# EAGLE design COM - ISP (EAGLE 4.11)
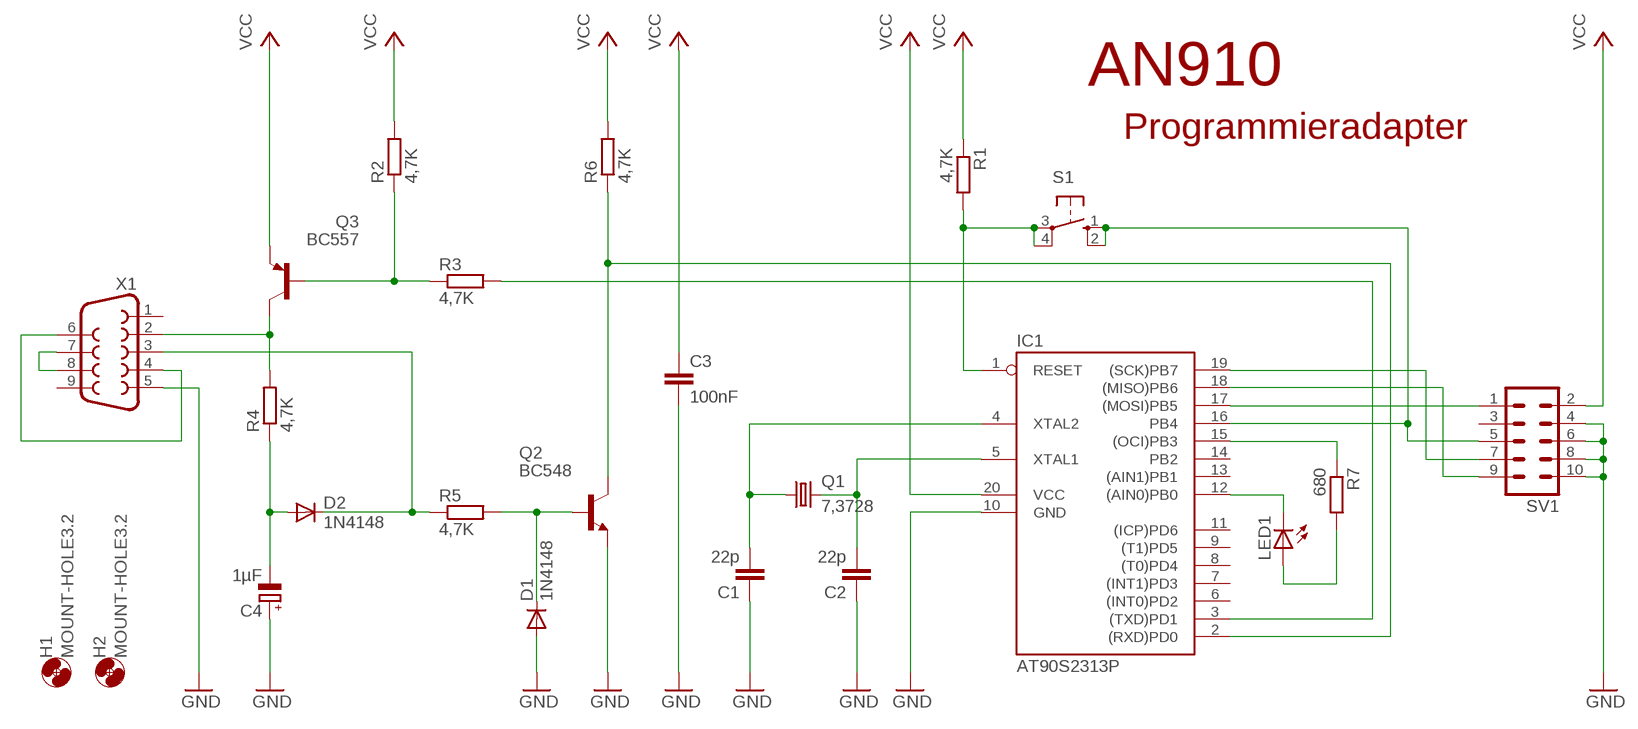
[diagram p0: schematic, sheet 1]

## Parts
C1  22p  C-EU025-024X044  [C025-024X044]
C2  22p  C-EU025-024X044  [C025-024X044]
C3  100nF  C-EU025-024X044  [C025-024X044]
C4  1µF  CPOL-EUE2.5-6  [E2,5-6]
D1  1N4148  BAS15  [DO34-7]
D2  1N4148  BAS15  [DO34-7]
H1  MOUNT-HOLE3.2  [3,2]
H2  MOUNT-HOLE3.2  [3,2]
IC1  AT90S2313P  [DIL20]
LED1  LED3MM  [LED3MM]
Q1  7,3728  CRYTALHC49U-V  [HC49U-V]
Q2  BC548  [TO92-EBC]
Q3  BC557  [TO92-EBC]
R1  4,7K  R-EU_0207/7  [0207/7]
R2  4,7K  R-EU_0207/7  [0207/7]
R3  4,7K  R-EU_0207/7  [0207/7]
R4  4,7K  R-EU_0207/7  [0207/7]
R5  4,7K  R-EU_0207/7  [0207/7]
R6  4,7K  R-EU_0207/7  [0207/7]
R7  680  R-EU_0207/7  [0207/7]
S1  10-XX  [B3F-10XX]
SV1  ML10L  [ML10L]
X1  F09HP  [F09HP]

## Nets
GND: C1.1 C2.1 C3.2 C4.+ D1.A IC1.10(GND) Q2.E SV1.4 SV1.6 SV1.8 SV1.10 X1.5
N$1: C1.2 IC1.4(XTAL2) Q1.1
N$2: C2.2 IC1.5(XTAL1) Q1.2
N$3: IC1.15((OCI)PB3) R7.1
N$4: LED1.A R7.2
N$5: IC1.12((AIN0)PB0) LED1.K(C)
N$7: IC1.1(RESET) R1.2 S1.3(P) S1.4(P1)
N$8: IC1.16(PB4) S1.1(S) S1.2(S1) SV1.5
N$9: IC1.19((SCK)PB7) SV1.7
N$10: IC1.18((MISO)PB6) SV1.9
N$11: IC1.17((MOSI)PB5) SV1.1
N$13: Q3.C R4.2 X1.2
N$15: Q3.B R2.1 R3.1
N$16: D1.C Q2.B R5.2
N$17: IC1.2((RXD)PD0) Q2.C R6.1
N$18: D2.C R5.1 X1.3
N$19: IC1.3((TXD)PD1) R3.2
N$20: C4.- D2.A R4.1
N$21: X1.7 X1.8
N$22: X1.4 X1.6
VCC: C3.1 IC1.20(VCC) Q3.E R1.1 R2.2 R6.2 SV1.2
Unconnected: IC1.6((INT0)PD2) IC1.7((INT1)PD3) IC1.8((T0)PD4) IC1.9((T1)PD5) IC1.11((ICP)PD6) IC1.13((AIN1)PB1) IC1.14(PB2) SV1.3 X1.1 X1.9

## Notes on the sheet
- AN910
- Programmieradapter

## Library data of the parts
C1-C3 = rcl:C-EU: CAPACITOR, European symbol
C4 = rcl:CPOL-EU: POLARIZED CAPACITOR, European symbol
D1 D2 = diode:BAS15: DIODE high speed
H1 H2 = holes:MOUNT-HOLE: MOUNTING HOLE with drill center marker
IC1 = atmel:AT90S2313: MICROCONTROLLER 2 Kbytes FLASH 128 bytes SRAM 128 bytes EEPROM UART
LED1 = led:LED: LED OSRAM: - CHIPLED LG R971, LG N971, LY N971, LG Q971, LY Q971, LO R971, LY R971 LH N974, LH R974 LS Q976, LO Q976, LY Q976 LO Q996 - Hyper CHIPLED LW Q18S LB Q993, LB Q99A, LB R99A - SideLED LS A670, LO A670, LY A670, LG A670, LP A670 LB A673, LV A673, LT A673, LW A673 LH A674 LY A675 LS A676, LA A676, LO A676, LY A676, LW A676 LS A679, LY A679, LG A679 - Hyper Micro SIDELED® LS Y876, LA Y876, LO Y876, LY Y876 LT Y87S - SmartLED LW L88C, LW L88S LB L89C, LB L89S, LG L890 LS L89K, LO L89K, LY L89K LS L896, LA L896, LO L896, LY L896 - TOPLED LS T670, LO T670, LY T670, LG T670, LP T670 LSG T670, LSP T670, LSY T670, LOP T670, LYG T670 LG T671, LOG T671, LSG T671 LB T673, LV T673, LT T673, LW T673 LH T674 LS T676, LA T676, LO T676, LY T676, LB T676, LH T676, LSB T676, LW T676 LB T67C, LV T67C, LT T67C, LS T67K, LO T67K, LY T67K, LW E67C LS E67B, LA E67B, LO E67B, LY E67B, LB E67C, LV E67C, LT E67C LW T67C LS T679, LY T679, LG T679 LS T770, LO T770, LY T770, LG T770, LP T770 LB T773, LV T773, LT T773, LW T773 LH T774 LS E675, LA E675, LY E675, LS T675 LS T776, LA T776, LO T776, LY T776, LB T776 LHGB T686 LT T68C, LB T68C - Hyper Mini TOPLED® LB M676 - Mini TOPLED Santana® LG M470 LS M47K, LO M47K, LY M47K Source: http://www.osram.convergy.de/
Q1 = crystal:CRYTAL: CRYSTAL
Q2 = transistor-npn:BC548*: NPN Transistor
Q3 = transistor-pnp:BC557*: PNP Transistror
R1-R7 = rcl:R-EU_: RESISTOR, European symbol
S1 = switch-omron:10-XX: OMRON SWITCH
SV1 = con-harting-ml:ML10: HARTING
X1 = con-subd:F09: SUB-D

## Board
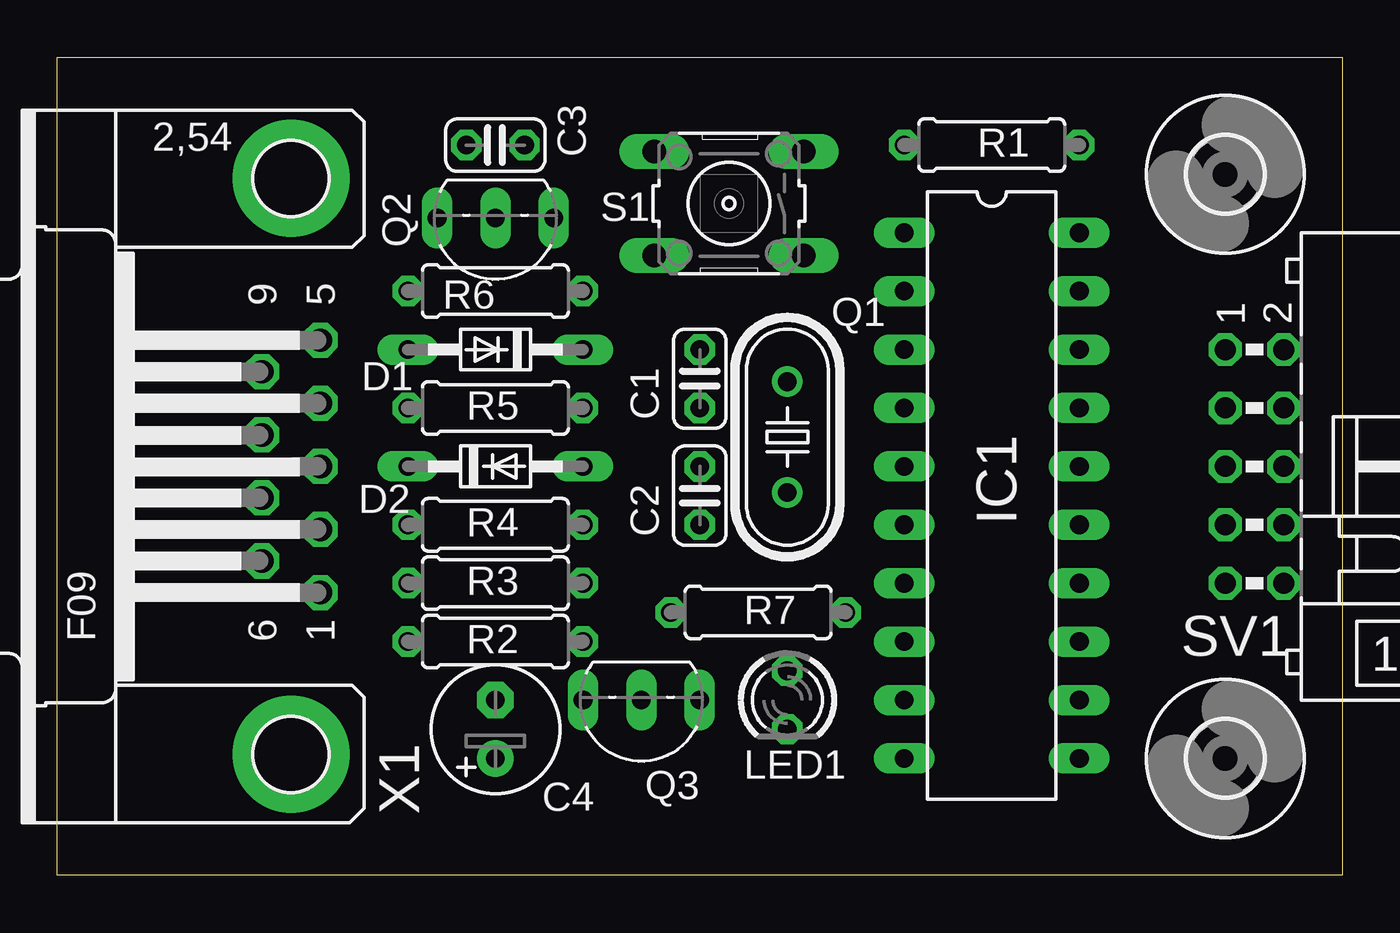
[diagram p1: board, top side]
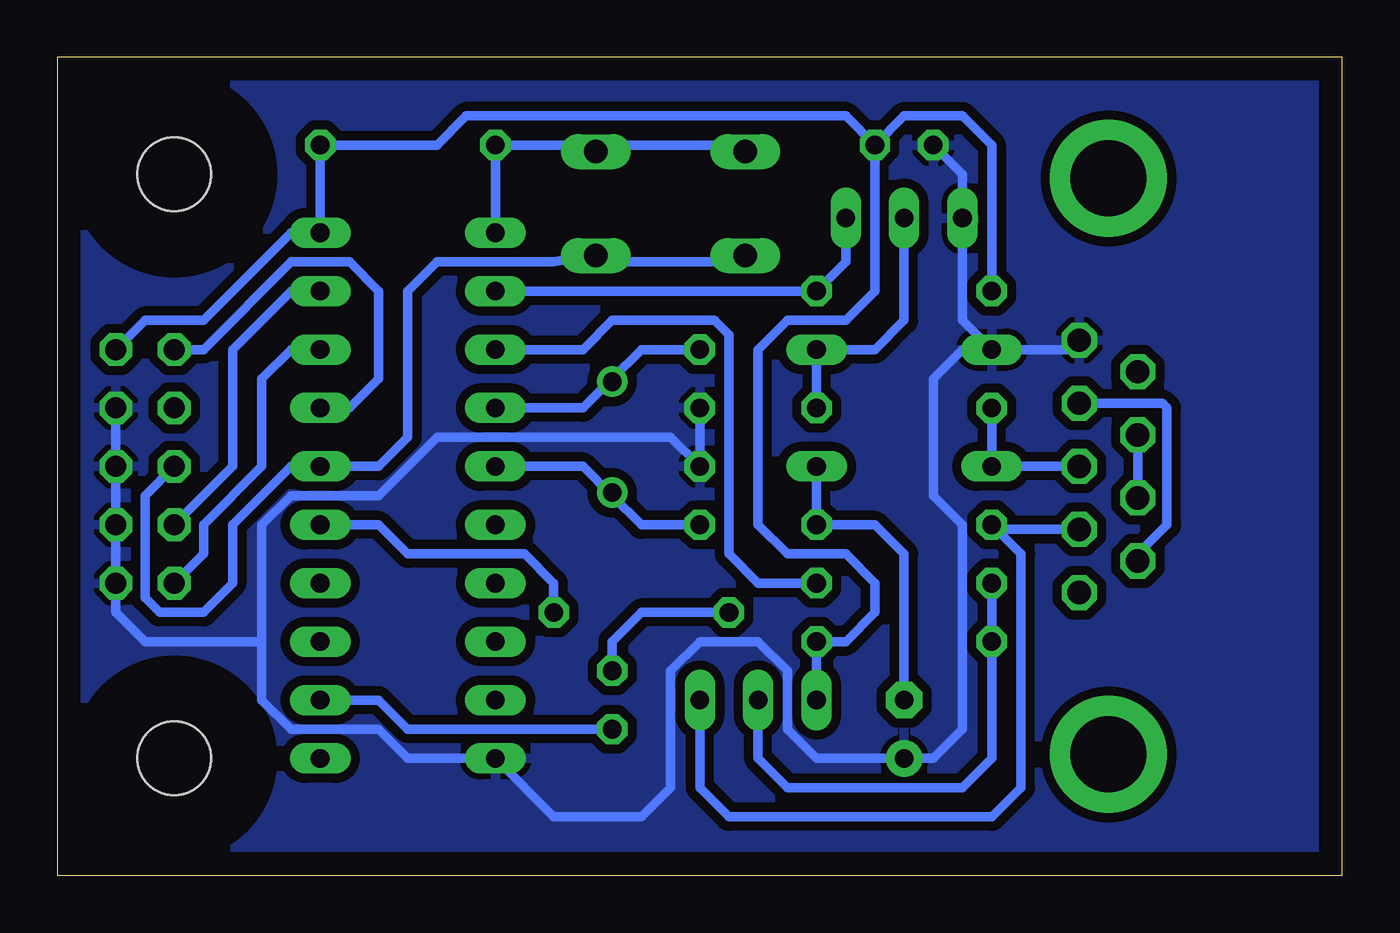
[diagram p2: board, bottom side, seen from below]

Size 55.88 x 35.56 mm. Coordinates in mm from the lower left corner, seen from the top.
Outline: 0,0 0,35.56 55.88,35.56 55.88,0 0,0
Copper layers (1*16): Top 0.035mm / dielectric 1.5mm / Bottom 0.035mm
Design rules "default": minimum track width 10mil, minimum drill 24mil, track to track 8mil, track to pad 8mil, pad to pad 8mil, via to via 8mil, smd to smd 8mil, copper to edge 40mil, drill to drill 8mil, minimum pad ring 10mil, minimum via ring 8mil, stop-mask expansion 4mil, vias tented up to drill 0mil, thermal gap 10mil

### Footprints (pad centres in the part's own frame; a part is rotated, then mirrored left to right if it is on the bottom)
C025-024X044 = drill 0.813 octagon: 1 -1.27,0; 2 1.27,0
E2,5-6 = drill 0.813 pad 1.6 round: + -1.27,0 | drill 0.813 pad 1.6 octagon: - 1.27,0
DO34-7 = drill 0.813 long: A 3.81,0; C -3.81,0
3,2 = hole 3.2: 0,0
DIL20 = drill 0.813 long: 1 -11.43,-3.81; 2 -8.89,-3.81; 3 -6.35,-3.81; 4 -3.81,-3.81; 5 -1.27,-3.81; 6 1.27,-3.81; 7 3.81,-3.81; 8 6.35,-3.81; 9 8.89,-3.81; 10 11.43,-3.81; 11 11.43,3.81; 12 8.89,3.81; 13 6.35,3.81; 14 3.81,3.81; 15 1.27,3.81; 16 -1.27,3.81; 17 -3.81,3.81; 18 -6.35,3.81; 19 -8.89,3.81; 20 -11.43,3.81
LED3MM = drill 0.813 octagon: A -1.27,0; K 1.27,0
HC49U-V = drill 0.813 round: 1 -2.413,0; 2 2.413,0
TO92-EBC = drill 0.813 long: B 0,-1.27; C -2.54,-1.27; E 2.54,-1.27
0207/7 = drill 0.813 octagon: 1 -3.81,0; 2 3.81,0
B3F-10XX = drill 1.016 long: 1 -3.251,2.261; 2 3.251,2.261; 3 -3.251,-2.261; 4 3.251,-2.261
ML10L = drill 0.914 octagon: 1 -5.08,-1.27; 2 -5.08,1.27; 3 -2.54,-1.27; 4 -2.54,1.27; 5 0,-1.27; 6 0,1.27; 7 2.54,-1.27; 8 2.54,1.27; 9 5.08,-1.27; 10 5.08,1.27
F09HP = drill 1.016 octagon: 1 -5.486,-1.27; 2 -2.743,-1.27; 3 0,-1.27; 4 2.743,-1.27; 5 5.486,-1.27; 6 -4.115,1.27; 7 -1.372,1.27; 8 1.372,1.27; 9 4.115,1.27 | drill 3.302 pad 5.08 round: G1 -12.522,0; G2 12.522,0

### Placement (x,y rotation side)
C1  27.94,21.59 90 top
C2  27.94,16.51 270 top
C3  19.05,31.75 180 top
C4  19.05,6.35 90 top
D1  19.05,22.86 180 top
D2  19.05,17.78 0 top
H1  50.8,5.08 0 top
H2  50.8,30.48 0 top
IC1  40.64,16.51 270 top
LED1  31.75,7.62 270 top
Q1  31.75,19.05 270 top
Q2  19.05,27.3 180 top
Q3  25.4,6.35 180 top
R1  40.64,31.75 180 top
R2  19.05,10.16 0 top
R3  19.05,12.7 0 top
R4  19.05,15.24 180 top
R5  19.05,20.32 0 top
R6  19.05,25.4 180 top
R7  30.48,11.43 180 top
S1  29.21,29.21 180 top
SV1  52.07,17.78 270 top
X1  10.16,17.78 90 top

### Tracks (layer width: path | path; a pad name or v marks a point on that pad's centre or on a via)
GND
  Bottom 0.406: SV1.4 SV1.6 SV1.8 SV1.10 53.34,11.43 52.07,10.16 46.99,10.16 | C1.1 C2.1 29.21,19.05 39.37,19.05 41.91,16.51 45.72,16.51 46.99,15.24 46.99,10.16 | C3.2 16.51,30.48 Q2.E 16.51,24.13 D1.A | D1.A 16.51,22.86 17.78,21.59 17.78,16.51 16.51,15.24 16.51,6.35 17.78,5.08 C4.+ 22.86,5.08 24.13,6.35 24.13,8.89 25.4,10.16 27.94,10.16 29.21,8.89 29.21,3.81 30.48,2.54 34.29,2.54 IC1.10 40.64,5.08 41.91,6.35 45.72,6.35 46.99,7.62 46.99,10.16 | X1.5 11.43,22.86 D1.A
  pour Bottom (isolate 0.406): -1.27,36.83 57.15,36.83 57.15,-1.27 -1.27,-1.27
N$1
  Bottom 0.406: IC1.4 33.02,20.32 31.75,21.59 | Q1.1 31.75,21.59 | 31.75,21.59 30.48,22.86 C1.2
N$2
  Bottom 0.406: IC1.5 33.02,17.78 31.75,16.51 | 31.75,16.51 Q1.2 | 31.75,16.51 30.48,15.24 C2.2
N$3
  Bottom 0.406: R7.1 34.29,12.7 35.56,13.97 40.64,13.97 41.91,15.24 IC1.15
N$4
  Bottom 0.406: R7.2 30.48,11.43 31.75,10.16 LED1.A
N$5
  Bottom 0.406: LED1.K 40.64,6.35 41.91,7.62 IC1.12
N$7
  Bottom 0.406: IC1.1 R1.2 33.02,31.75 32.74,31.47 S1.3 32.03,31.47 31.75,31.75 26.67,31.75 26.39,31.47 S1.4
N$8
  Bottom 0.406: SV1.5 52.07,16.51 52.07,12.06 51.44,11.43 49.53,11.43 48.26,12.7 48.26,15.24 45.72,17.78 IC1.16 41.91,17.78 40.64,19.05 40.64,25.4 39.37,26.67 34.29,26.67 32.74,26.95 S1.1 32.03,26.95 31.75,26.67 26.67,26.67 26.39,26.95 S1.2
N$9
  Bottom 0.406: IC1.19 45.72,25.4 48.26,22.86 48.26,17.78 SV1.7
N$10
  Bottom 0.406: IC1.18 45.72,22.86 46.99,21.59 46.99,17.78 49.53,15.24 49.53,13.97 SV1.9
N$11
  Bottom 0.406: IC1.17 43.18,20.32 41.91,21.59 41.91,25.4 43.18,26.67 45.72,26.67 49.53,22.86 SV1.1
N$13
  Bottom 0.406: X1.2 15.04,15.04 R4.2 13.97,13.97 13.97,3.81 15.24,2.54 26.67,2.54 27.94,3.81 Q3.C
N$15
  Bottom 0.406: R3.1 R2.1 15.24,5.08 16.51,3.81 24.13,3.81 25.4,5.08 Q3.B
N$16
  Bottom 0.406: Q2.B 19.05,24.13 20.32,22.86 D1.C R5.2
N$17
  Bottom 0.406: Q2.C 21.59,26.67 R6.1 IC1.2
N$18
  Bottom 0.406: X1.3 D2.C R5.1
N$19
  Bottom 0.406: IC1.3 33.02,22.86 31.75,24.13 27.3,24.13 26.67,23.5 26.67,13.97 25.4,12.7 R3.2
N$20
  Bottom 0.406: C4.- 19.05,13.97 20.32,15.24 R4.1 D2.A
N$21
  Bottom 0.406: X1.7 X1.8
N$22
  Bottom 0.406: X1.4 7.82,20.52 7.62,20.32 7.62,15.24 8.89,13.97 X1.6
VCC
  Bottom 0.406: SV1.2 52.07,24.13 49.53,24.13 45.72,27.94 IC1.20 R1.1 39.37,31.75 38.1,33.02 21.59,33.02 C3.1 | R6.2 15.24,31.75 16.51,33.02 19.05,33.02 C3.1 | C3.1 20.32,25.4 21.59,24.13 24.13,24.13 25.4,22.86 25.4,15.24 24.13,13.97 21.59,13.97 20.32,12.7 20.32,11.43 21.59,10.16 R2.2 Q3.E

### Text on the board
Measures: 50 mm | 36 mm